# EAGLE design R2p_DCM_v2 (EAGLE 6.2)
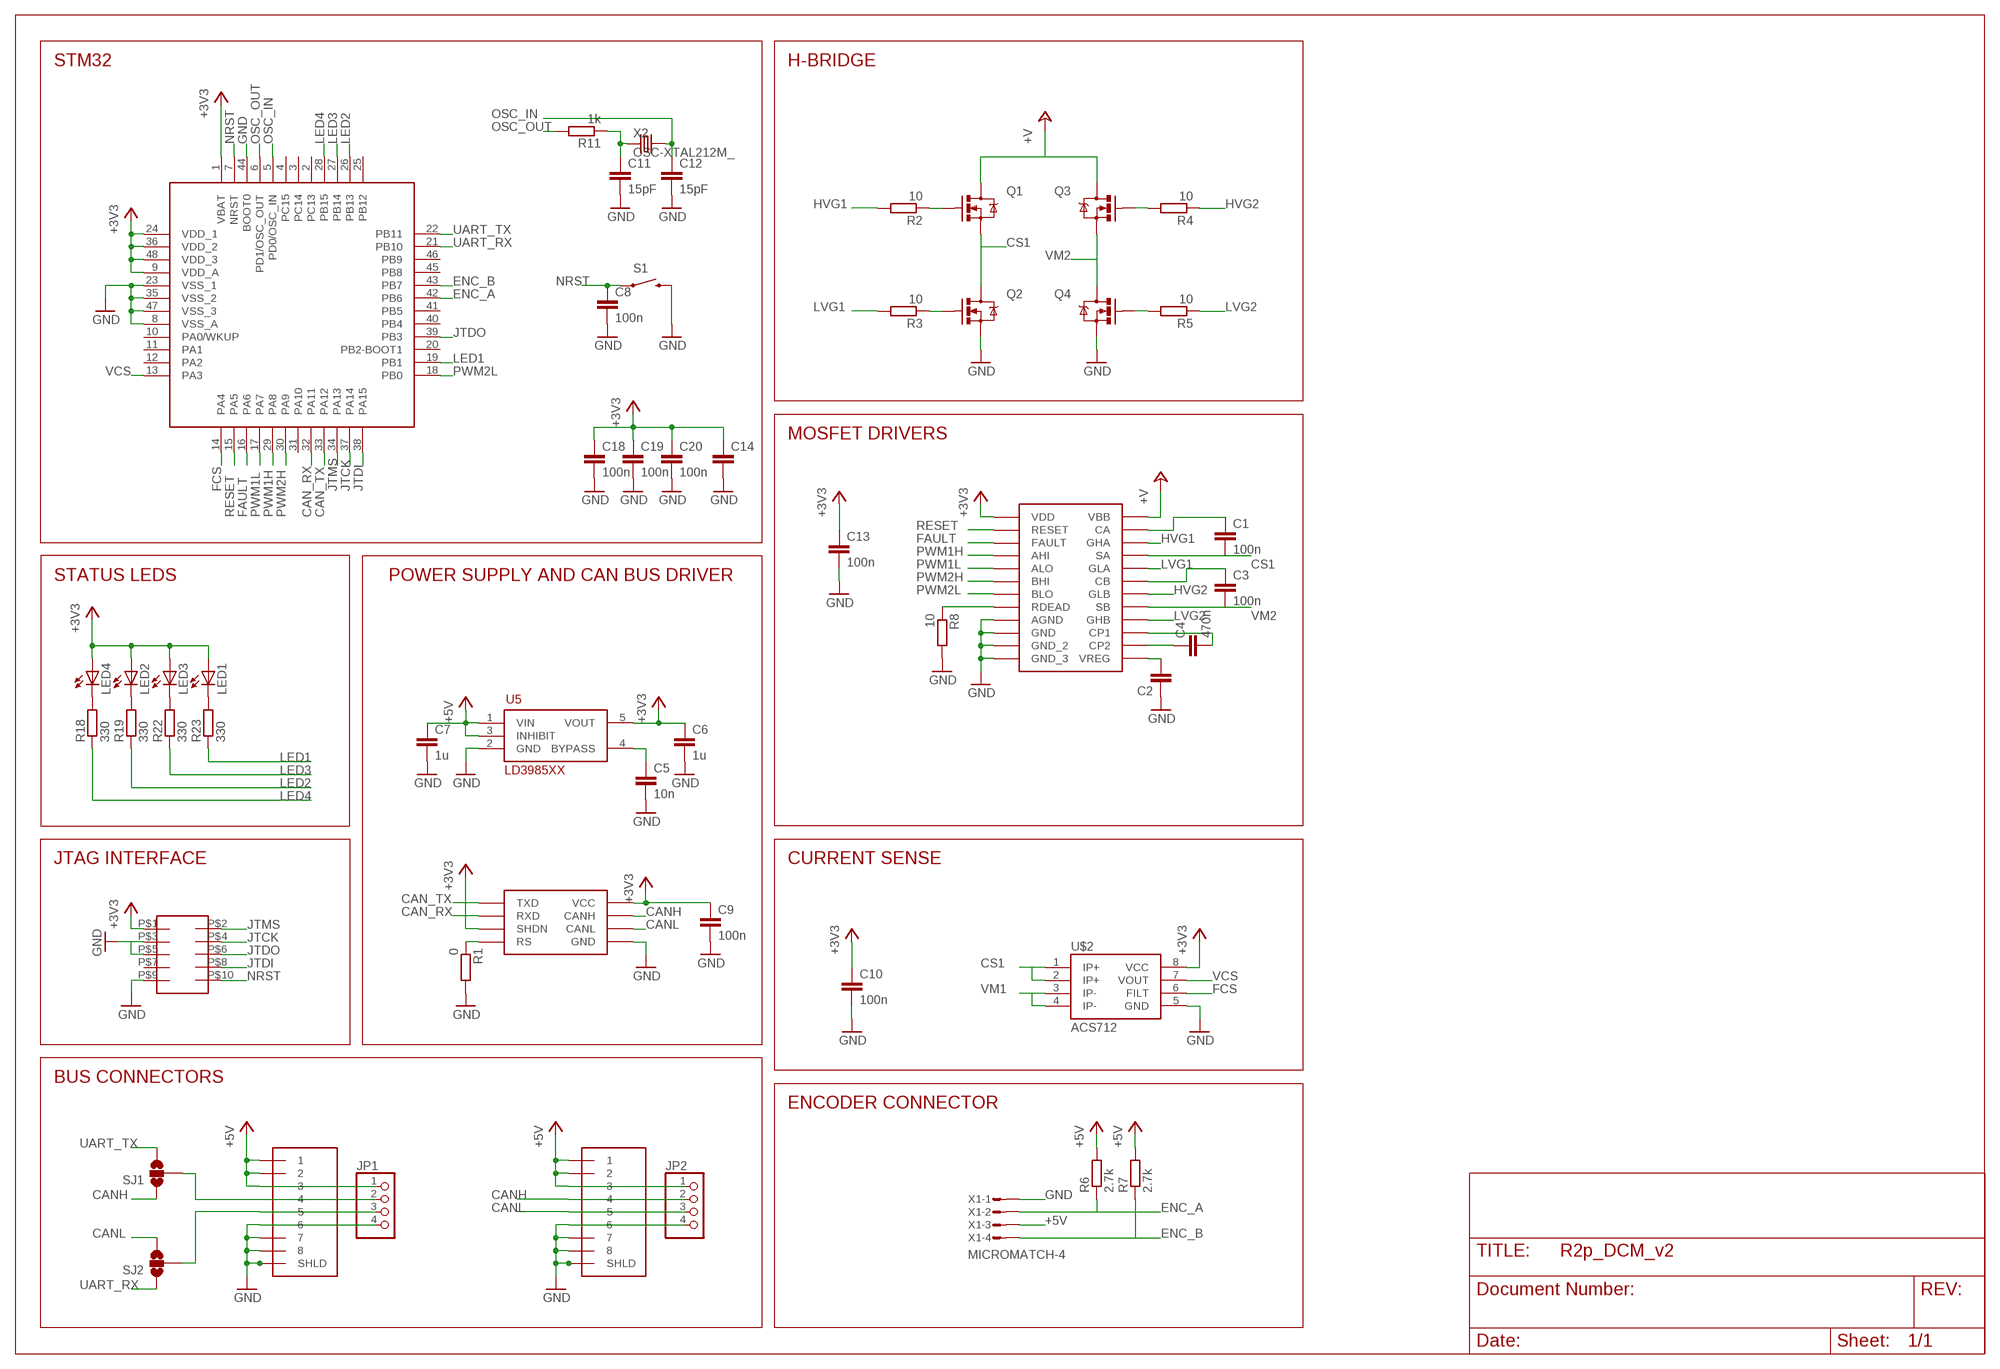
[diagram p0: schematic, sheet 1]

## Parts
1  RJ45-43860  [0438600010]
2  RJ45-43860  [0438600010]
C1  100n  C-EUC0603  [C0603]
C2  C-EUC0805  [C0805]
C3  100n  C-EUC0603  [C0603]
C4  470n  C-EUC0603  [C0603]
C5  10n  C-EUC0603  [C0603]
C6  1u  C-EUC0603  [C0603]
C7  1u  C-EUC0603  [C0603]
C8  100n  C-EUC0603  [C0603]
C9  100n  C-EUC0603  [C0603]
C10  100n  C-EUC0603  [C0603]
C11  15pF  C-EUC0603  [C0603]
C12  15pF  C-EUC0603  [C0603]
C13  100n  C-EUC0603  [C0603]
C14  C-EUC0805  [C0805]
C18  100n  C-EUC0603  [C0603]
C19  100n  C-EUC0603  [C0603]
C20  100n  C-EUC0603  [C0603]
JP1  PINHD-1X4/90  [1X04/90]
JP2  PINHD-1X4/90  [1X04/90]
LED1  LEDCHIPLED_0805  [CHIPLED_0805]
LED2  LEDCHIPLED_0805  [CHIPLED_0805]
LED3  LEDCHIPLED_0805  [CHIPLED_0805]
LED4  LEDCHIPLED_0805  [CHIPLED_0805]
Q1  MOSFET-NCHANNELFDD8580  [DPAK]
Q2  MOSFET-NCHANNELFDD8580  [DPAK]
Q3  MOSFET-NCHANNELFDD8580  [DPAK]
Q4  MOSFET-NCHANNELFDD8580  [DPAK]
R1  0  R-EU_R0603  [R0603]
R2  10  R-EU_R0603  [R0603]
R3  10  R-EU_R0603  [R0603]
R4  10  R-EU_R0603  [R0603]
R5  10  R-EU_R0603  [R0603]
R6  2.7k  R-EU_R0603  [R0603]
R7  2.7k  R-EU_R0603  [R0603]
R8  10  R-EU_R0603  [R0603]
R11  1k  R-EU_R0603  [R0603]
R18  330  R-EU_R0603  [R0603]
R19  330  R-EU_R0603  [R0603]
R22  330  R-EU_R0603  [R0603]
R23  330  R-EU_R0603  [R0603]
S1  SWITCH-MOMENTARY-2-SMD-1101NE  [TACTILE-SWITCH-1101NE]
SJ1  SOLDERJUMPER_2WAYPASTE1&2  [SJ_3_PASTE1&2]
SJ2  SOLDERJUMPER_2WAYPASTE1&2  [SJ_3_PASTE1&2]
SOT1  MAX3051  [SOT23-8L]
U1  STM32F103CX  [LQFP48]
U5  LD3985XX  [SOT23-5L]
U$1  A4940  [TSSOP24]
U$2  ACS712  [SO08]
U$4  FTSH-105  [FTSH-105]
X1  MICROMATCH-4  [MICROMATCH-4]
X2  OSC-XTAL212M_  [4X6]

## Nets
+3V3: C6.1 C9.1 C10.1 C13.1 C14.1 C18.1 C19.1 C20.1 LED1.A LED2.A LED3.A LED4.A SOT1.P$3(VCC) SOT1.P$5(SHDN) U1.1(VBAT) U1.9(VDD_A) U1.24(VDD_1) U1.36(VDD_2) U1.48(VDD_3) U5.5(VOUT) U$1.21(VDD) U$2.8(VCC) U$4.P$1
+5V: 1.P$1 1.P$2 1.P$3 2.P$1 2.P$2 2.P$3 C7.1 JP1.1 JP2.1 R6.2 R7.2 U5.1(VIN) U5.3(INHIBIT) X1.3
+V: Q1.4(D) Q3.4(D) U$1.12(VBB)
CAN_RX: SOT1.P$4(RXD) U1.32(PA11)
CAN_TX: SOT1.P$1(TXD) U1.33(PA12)
CANH: 2.P$4 JP2.2 SJ1.1 SOT1.P$7(CANH)
CANL: 2.P$5 JP2.3 SJ2.3 SOT1.P$6(CANL)
CS1: C1.2 Q1.3(S) Q2.4(D) U$1.10(SA) U$2.1(IP+) U$2.2(IP+)
ENC_A: R6.1 U1.42(PB6) X1.2
ENC_B: R7.1 U1.43(PB7) X1.4
FAULT: U1.16(PA6) U$1.24(FAULT)
FCS: U1.14(PA4) U$2.6(FILT)
GND: 1.P$6 1.P$7 1.P$8 1.P$9(SHLD) 1.P$10 2.P$6 2.P$7 2.P$8 2.P$9(SHLD) 2.P$10 C2.1 C5.2 C6.2 C7.2 C8.2 C9.2 C10.2 C11.2 C12.2 C13.2 C14.2 C18.2 C19.2 C20.2 JP1.4 JP2.4 Q2.3(S) Q4.3(S) R1.2 R8.2 S1.P$2 SOT1.P$2(GND) U1.8(VSS_A) U1.23(VSS_1) U1.35(VSS_2) U1.44(BOOT0) U1.47(VSS_3) U5.2(GND) U$1.2(GND) U$1.15(GND_2) U$1.16(GND_3) U$1.22(AGND) U$2.5(GND) U$4.P$3 U$4.P$9 X1.1
HVG1: R2.2 U$1.9(GHA)
HVG2: R4.1 U$1.3(GLB)
JTCK: U1.37(PA14) U$4.P$4
JTDI: U1.38(PA15) U$4.P$8
JTDO: U1.39(PB3) U$4.P$6
JTMS: U1.34(PA13) U$4.P$2
LED1: R23.1 U1.19(PB1)
LED2: R19.1 U1.26(PB13)
LED3: R22.1 U1.27(PB14)
LED4: R18.1 U1.28(PB15)
LVG1: R3.2 U$1.11(GLA)
LVG2: R5.1 U$1.5(GHB)
N$1: U$4.P$5
N$2: R1.1 SOT1.P$8(RS)
N$3: 1.P$4 JP1.2 SJ1.2
N$4: C5.1 U5.4(BYPASS)
N$5: Q1.1(G) R2.1
N$6: Q2.1(G) R3.1
N$7: Q3.1(G) R4.2
N$8: 1.P$5 JP1.3 SJ2.2
N$9: Q4.1(G) R5.2
N$10: C4.1 U$1.13(CP2)
N$11: C4.2 U$1.14(CP1)
N$12: C11.1 R11.1 X2.1(X1)
N$13: C2.2 U$1.7(VREG)
N$15: LED4.C R18.2
N$16: C3.1 U$1.6(CB)
N$17: R8.1 U$1.23(RDEAD)
N$18: LED2.C R19.2
N$20: LED3.C R22.2
N$22: LED1.C R23.2
N$26: C1.1 U$1.8(CA)
NRST: C8.1 S1.P$1 U1.7(NRST) U$4.P$10
OSC_IN: C12.1 U1.5(PD0/OSC_IN) X2.2(X2)
OSC_OUT: R11.2 U1.6(PD1/OSC_OUT)
PWM1H: U1.29(PA8) U$1.20(AHI)
PWM1L: U1.17(PA7) U$1.19(ALO)
PWM2H: U1.30(PA9) U$1.18(BHI)
PWM2L: U1.18(PB0) U$1.17(BLO)
RESET: U1.15(PA5) U$1.1(RESET)
UART_RX: SJ2.1 U1.21(PB10)
UART_TX: SJ1.3 U1.22(PB11)
VCS: U1.13(PA3) U$2.7(VOUT)
VM1: U$2.3(IP-) U$2.4(IP-)
VM2: C3.2 Q3.3(S) Q4.4(D) U$1.4(SB)
Unconnected: U1.2(PC13) U1.3(PC14) U1.4(PC15) U1.10(PA0/WKUP) U1.11(PA1) U1.12(PA2) U1.20(PB2-BOOT1) U1.25(PB12) U1.31(PA10) U1.40(PB4) U1.41(PB5) U1.45(PB8) U1.46(PB9) U$4.P$7

## Notes on the sheet
- STM32 | H-BRIDGE
- MOSFET DRIVERS
- STATUS LEDS | POWER SUPPLY AND CAN BUS DRIVER
- JTAG INTERFACE | CURRENT SENSE
- BUS CONNECTORS
- ENCODER CONNECTOR

## Library data of the parts
1 2 = molex:RJ45-43860
C1-C14 C18-C20 = rcl:C-EU: CAPACITOR, European symbol
JP1 JP2 = pinhead:PINHD-1X4: PIN HEADER
LED1-LED4 = led:LED: LED OSRAM: - CHIPLED LG R971, LG N971, LY N971, LG Q971, LY Q971, LO R971, LY R971 LH N974, LH R974 LS Q976, LO Q976, LY Q976 LO Q996 - Hyper CHIPLED LW Q18S LB Q993, LB Q99A, LB R99A - SideLED LS A670, LO A670, LY A670, LG A670, LP A670 LB A673, LV A673, LT A673, LW A673 LH A674 LY A675 LS A676, LA A676, LO A676, LY A676, LW A676 LS A679, LY A679, LG A679 - Hyper Micro SIDELED® LS Y876, LA Y876, LO Y876, LY Y876 LT Y87S - SmartLED LW L88C, LW L88S LB L89C, LB L89S, LG L890 LS L89K, LO L89K, LY L89K LS L896, LA L896, LO L896, LY L896 - TOPLED LS T670, LO T670, LY T670, LG T670, LP T670 LSG T670, LSP T670, LSY T670, LOP T670, LYG T670 LG T671, LOG T671, LSG T671 LB T673, LV T673, LT T673, LW T673 LH T674 LS T676, LA T676, LO T676, LY T676, LB T676, LH T676, LSB T676, LW T676 LB T67C, LV T67C, LT T67C, LS T67K, LO T67K, LY T67K, LW E67C LS E67B, LA E67B, LO E67B, LY E67B, LB E67C, LV E67C, LT E67C LW T67C LS T679, LY T679, LG T679 LS T770, LO T770, LY T770, LG T770, LP T770 LB T773, LV T773, LT T773, LW T773 LH T774 LS E675, LA E675, LY E675, LS T675 LS T776, LA T776, LO T776, LY T776, LB T776 LHGB T686 LT T68C, LB T68C - Hyper Mini TOPLED® LB M676 - Mini TOPLED Santana® LG M470 LS M47K, LO M47K, LY M47K Source: http://www.osram.convergy.de LUXEON: - LUMILED® LXK2-PW12-R00, LXK2-PW12-S00, LXK2-PW14-U00, LXK2-PW14-V00 LXK2-PM12-R00, LXK2-PM12-S00, LXK2-PM14-U00 LXK2-PE12-Q00, LXK2-PE12-R00, LXK2-PE12-S00, LXK2-PE14-T00, LXK2-PE14-U00 LXK2-PB12-K00, LXK2-PB12-L00, LXK2-PB12-M00, LXK2-PB14-N00, LXK2-PB14-P00, LXK2-PB14-Q00 LXK2-PR12-L00, LXK2-PR12-M00, LXK2-PR14-Q00, LXK2-PR14-R00 LXK2-PD12-Q00, LXK2-PD12-R00, LXK2-PD12-S00 LXK2-PH12-R00, LXK2-PH12-S00 LXK2-PL12-P00, LXK2-PL12-Q00, LXK2-PL12-R00 Source: www.luxeon.com KINGBRIGHT: KA-3528ASYC Source: www.kingbright.com
Q1-Q4 = SparkFun:MOSFET-NCHANNEL
R1-R8 R11 R18 R19 R22 R23 = rcl:R-EU_: RESISTOR, European symbol
S1 = SparkFun:SWITCH-MOMENTARY-2
SJ1 SJ2 = SparkFun:SOLDERJUMPER_2WAY: Solder Jumper 2 way solder jumper
SOT1 = maxim:MAX3051
U1 = st:STM32F103CX
U5 = st:LD3985XX
U$1 = allegro:A4940
U$2 = SparkFun:ACS712
U$4 = samtec:FTSH-105
X1 = apbteam_con-amp-micromatch:MICROMATCH-4: MicroMaTch 4
X2 = dp_devices:OSC-XTAL2

## Board
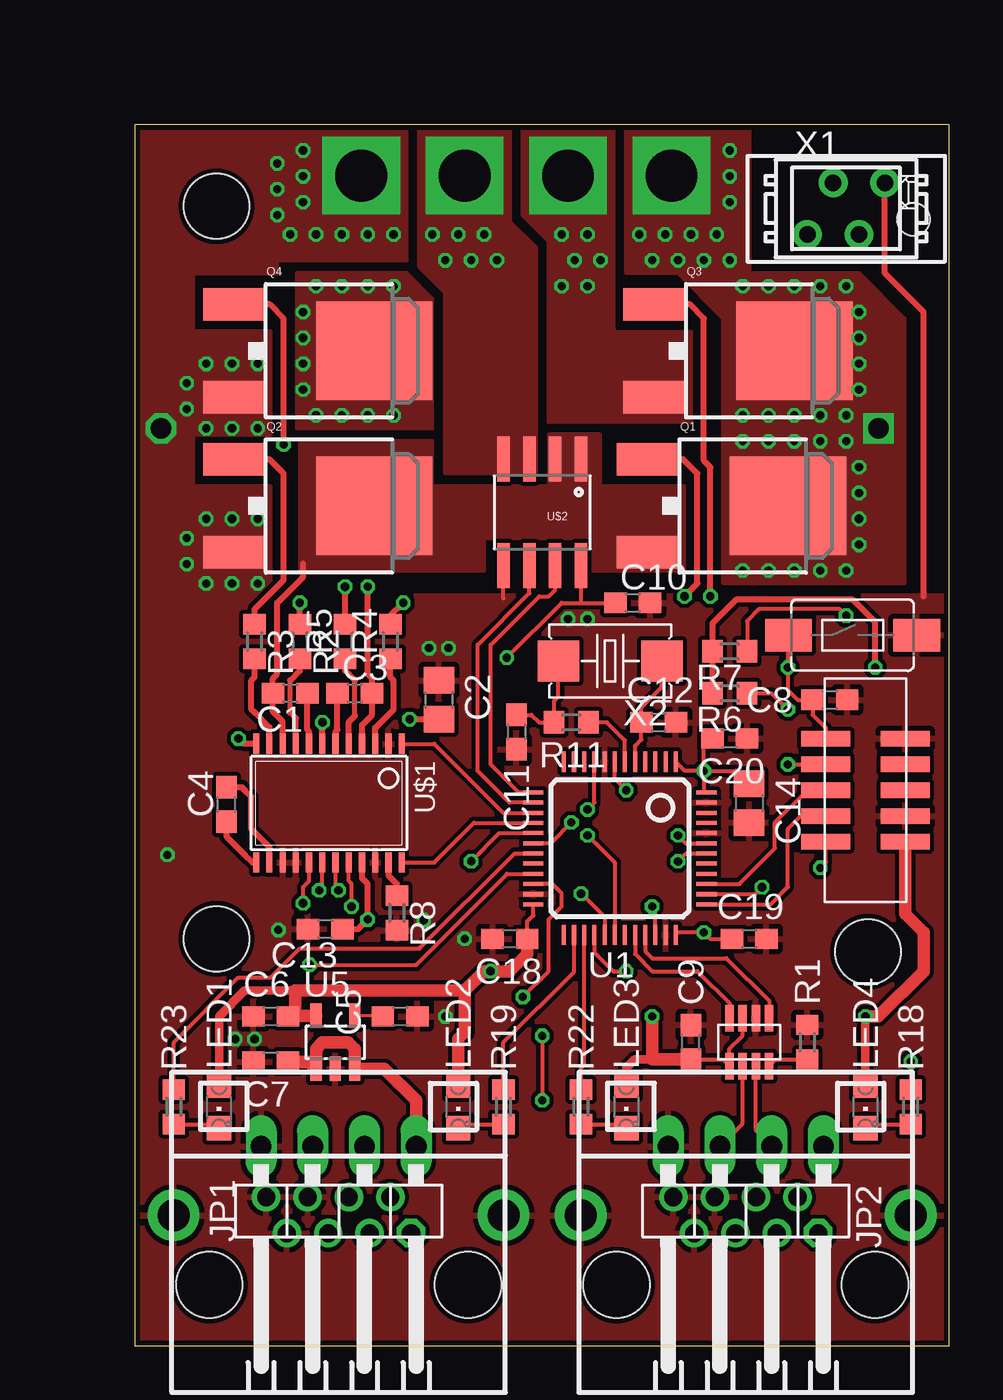
[diagram p1: board, top side]
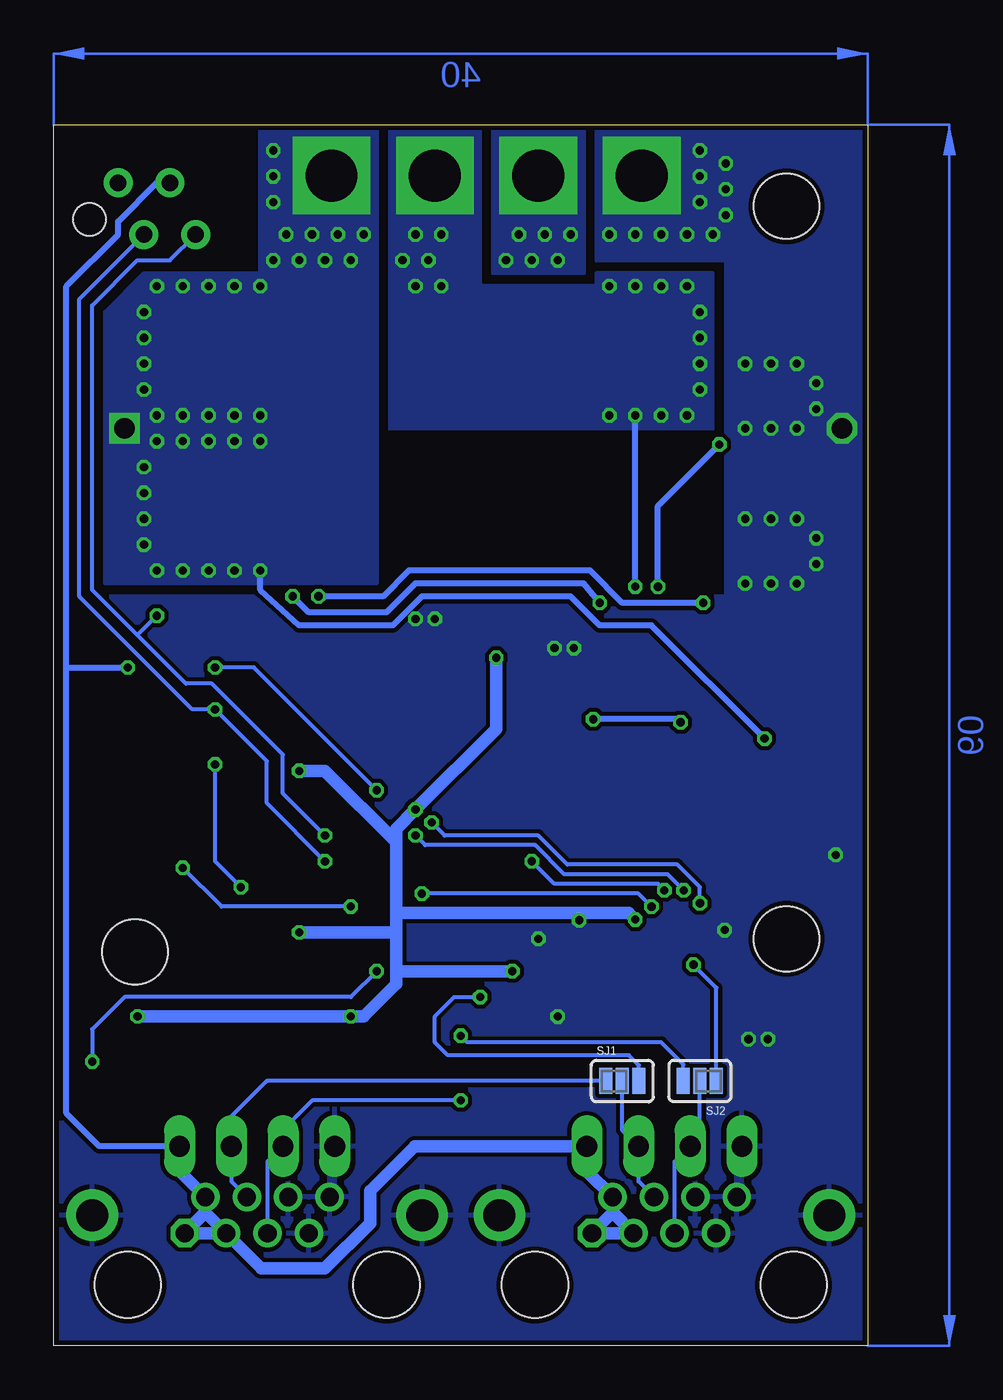
[diagram p2: board, bottom side, seen from below]

Size 40 x 60 mm. Coordinates in mm from the lower left corner, seen from the top.
Outline: 0,0 40,0 40,60 0,60 0,0
Copper layers (1*16): Top 0.035mm / dielectric 1.5mm / Bottom 0.035mm
Design rules: minimum track width 8mil, minimum drill 0.4mm, track to track 8mil, track to pad 8mil, pad to pad 8mil, via to via 8mil, smd to smd 0mil, copper to edge 10mil, drill to drill 10mil, minimum pad ring 10mil, minimum via ring 6mil, stop-mask expansion 2mil, vias tented up to drill 100mil, thermal gap 10mil
Holes 3.2 mm at 4,20 36,19.36 4,56

### Footprints (pad centres in the part's own frame; a part is rotated, then mirrored left to right if it is on the bottom)
0438600010 = drill 0.889 octagon: P$1 3.556,2.54 | drill 0.889: P$2 2.54,4.318; P$3 1.524,2.54; P$4 0.508,4.318; P$5 -0.508,2.54; P$6 -1.524,4.318; P$7 -2.54,2.54; P$8 -3.556,4.318 | drill 1.575 pad 2.54: P$9 8.103,3.429; P$10 -8.103,3.429 | hole 3.251: -6.35,0; 6.35,0
C0603 = smd 1.1 x 1: 1 -0.85,0; 2 0.85,0
C0805 = smd 1.3 x 1.5: 1 -0.95,0; 2 0.95,0
1X04/90 = drill 1.016 long: 1 -3.81,-3.81; 2 -1.27,-3.81; 3 1.27,-3.81; 4 3.81,-3.81
CHIPLED_0805 = smd 1.2 x 1.2: A 0,-1.05; C 0,1.05
DPAK = smd 1.6 x 3: 1 -2.28,-5.31; 3 2.28,-5.31 | smd 4.826 x 5.715: 4 0,1.588
R0603 = smd 1 x 1.1: 1 -0.85,0; 2 0.85,0
TACTILE-SWITCH-1101NE = smd 2.3 x 1.6: P$1 -3.15,0; P$2 3.15,0
SJ_3_PASTE1&2 = smd 0.635 x 1.27: 1 -0.813,0; 2 0,0; 3 0.813,0
SOT23-8L@1 = smd 1.3 x 0.42: P$1 -1.175,1.3; P$2 -1.175,0.65; P$3 -1.175,0; P$4 -1.175,-0.65; P$5 1.175,-0.65; P$6 1.175,0; P$7 1.175,0.65; P$8 1.175,1.3
LQFP48 = smd 1 x 0.2: 1 -4.25,2.75; 2 -4.25,2.25; 3 -4.25,1.75; 4 -4.25,1.25; 5 -4.25,0.75; 6 -4.25,0.25; 7 -4.25,-0.25; 8 -4.25,-0.75; 9 -4.25,-1.25; 10 -4.25,-1.75; 11 -4.25,-2.25; 12 -4.25,-2.75; 25 4.25,-2.75; 26 4.25,-2.25; 27 4.25,-1.75; 28 4.25,-1.25; 29 4.25,-0.75; 30 4.25,-0.25; 31 4.25,0.25; 32 4.25,0.75; 33 4.25,1.25; 34 4.25,1.75; 35 4.25,2.25; 36 4.25,2.75 | smd 0.2 x 1: 13 -2.75,-4.25; 14 -2.25,-4.25; 15 -1.75,-4.25; 16 -1.25,-4.25; 17 -0.75,-4.25; 18 -0.25,-4.25; 19 0.25,-4.25; 20 0.75,-4.25; 21 1.25,-4.25; 22 1.75,-4.25; 23 2.25,-4.25; 24 2.75,-4.25; 37 2.75,4.25; 38 2.25,4.25; 39 1.75,4.25; 40 1.25,4.25; 41 0.75,4.25; 42 0.25,4.25; 43 -0.25,4.25; 44 -0.75,4.25; 45 -1.25,4.25; 46 -1.75,4.25; 47 -2.25,4.25; 48 -2.75,4.25
SOT23-5L = smd 0.55 x 1.2: 1 -0.95,-1.3; 2 0,-1.3; 3 0.95,-1.3; 4 0.95,1.3; 5 -0.95,1.3
TSSOP24 = smd 0.305 x 0.991: 1 -3.575,-2.918; 2 -2.925,-2.918; 3 -2.275,-2.918; 4 -1.625,-2.918; 5 -0.975,-2.918; 6 -0.325,-2.918; 7 0.325,-2.918; 8 0.975,-2.918; 9 1.625,-2.918; 10 2.275,-2.918; 11 2.925,-2.918; 12 3.575,-2.918; 13 3.575,2.918; 14 2.925,2.918; 15 2.275,2.918; 16 1.625,2.918; 17 0.975,2.918; 18 0.325,2.918; 19 -0.325,2.918; 20 -0.975,2.918; 21 -1.625,2.918; 22 -2.275,2.918; 23 -2.925,2.918; 24 -3.575,2.918
SO08 = smd 0.61 x 2.21: 1 -1.905,-2.616; 2 -0.635,-2.616; 3 0.635,-2.616; 4 1.905,-2.616; 5 1.905,2.616; 6 0.635,2.616; 7 -0.635,2.616; 8 -1.905,2.616
FTSH-105 = smd 0.76 x 2.4: P$1 -2.54,-1.95; P$2 -2.54,1.95; P$3 -1.27,-1.95; P$4 -1.27,1.95; P$5 0,-1.95; P$6 0,1.95; P$7 1.27,-1.95; P$8 1.27,1.95; P$9 2.54,-1.95; P$10 2.54,1.95
MICROMATCH-4 = drill 0.813 pad 1.422: 1 1.905,1.27; 2 0.635,-1.27; 3 -0.635,1.27; 4 -1.905,-1.27 | hole 1.6: 3.305,-0.53
4X6 = smd 2.032 x 2.032: 1 -2.54,0; 2 2.54,0

### Placement (x,y rotation side)
1  10,3 0 top
2  30,3 0 top
C1  7.62,32.07 180 top
C2  14.92,31.75 270 top
C3  10.79,32.07 0 top
C4  4.49,26.61 90 top
C5  13.02,16.19 0 top
C6  6.67,16.19 180 top
C7  6.67,13.97 180 top
C8  34.13,31.75 0 top
C9  27.3,14.92 90 top
C10  24.45,36.51 0 top
C11  18.73,30.16 270 top
C12  25.72,30.64 0 top
C13  9.34,20.48 180 top
C14  30.16,26.67 270 top
C18  18.41,20 180 top
C19  30.16,20 0 top
C20  29.21,29.84 0 top
JP1  10,6 180 top
JP2  30,6 180 top
LED1  4.13,11.75 180 top
LED2  15.88,11.75 180 top
LED3  24.13,11.75 180 top
LED4  35.88,11.75 180 top
Q1  30.48,41.27 270 top
Q2  10.16,41.27 270 top
Q3  30.8,48.9 270 top
Q4  10.16,48.9 270 top
R1  33.02,14.92 90 top
R2  8.1,34.61 270 top
R3  5.87,34.61 270 top
R4  12.54,34.61 90 top
R5  10.32,34.61 90 top
R6  29.21,32.07 180 top
R7  29.21,34.13 180 top
R8  12.86,21.27 270 top
R11  21.43,30.64 0 top
R18  38.1,11.75 270 top
R19  18.1,11.75 270 top
R22  21.91,11.75 270 top
R23  1.91,11.75 270 top
S1  35.24,34.92 0 top
SJ1  12.06,13.02 0 bottom
SJ2  8.26,13.02 180 bottom
SOT1  MAX3051  [SOT23-8L@1]  29.84,14.92 270 top
U1  23.81,24.45 270 top
U5  9.84,14.92 0 top
U$1  9.53,26.67 180 top
U$2  20,40.96 180 top
U$4  35.88,27.3 90 top
X1  34.92,55.88 0 top
X2  23.34,33.66 0 top

### Tracks (layer width: path | path; a pad name or v marks a point on that pad's centre or on a via)
+3V3  (via drill 0.4, 0.41)
  Top 0.203: U1.36 26.68,20.32 v27.94,20.32 28.26,20 C19.1 | C9.1 28.87,14.07 SOT1.P$5 29.2,14.59 29.84,15.24 SOT1.P$3 | U1.48 27.94,27.32 v27.94,28.26 | U1.1 27,28.26 v27.94,28.26 | LED4.A 35.88,13.97 | U1.9 22.56,26.69 v22.23,26.35 | C14.1 29.52,28.26 v27.94,28.26 | v27.94,28.26 27.94,29.43 C20.1 | 21.91,36.51 C10.1 | 21.91,36.51 U$2.8 | U1.24 19.56,21.15 19.27,20.85 C18.1 | 21.91,36.51 20.95,36.51 v18.26,33.81
  Top 0.254: 7.87,16.22 C6.1
  Top 0.305: U$1.21 11.15,22.98 11.43,22.7 v11.43,20.95 | v11.43,20.95 | C13.1 10.95,20.48 v11.43,20.95
  Top 0.406: LED1.A 4.13,16.19 5.4,17.46 7.87,17.46 | 25.4,14.07 24.55,14.07 24.13,13.65 LED3.A | v35.88,16.19 LED4.A
  Top 0.61: U5.5 7.87,16.22 7.87,17.46 16.19,17.46 | 16.19,17.46 17.14,18.41 v17.46,18.41 18.41,18.41 19.27,19.27 C18.1 | C9.1 25.4,14.07 v25.4,16.19 | U$4.P$1 37.83,21.23 38.73,20.32 38.73,18.41 36.51,16.19 v35.88,16.19 | 16.19,17.46 16.19,15.4 15.88,15.08 LED2.A
  Bottom 0.61: v17.46,18.41 23.18,18.41 | v35.88,16.19 v25.4,16.19 24.77,16.19 23.18,17.78 23.18,18.41 | 23.18,24.77 23.18,25.4 v22.23,26.35 18.26,30.32 v18.26,33.81 | 23.18,18.41 23.18,20.32 | 23.18,20.32 23.18,21.27 | 23.18,21.27 23.18,24.77 | v27.94,28.26 26.67,28.26 23.18,24.77 | 23.18,20.32 v27.94,20.32 | v11.43,20.95 11.75,21.27 23.18,21.27
  other vias: 11.43,20.96
+5V  (via drill 0.4)
  Top 0.305: R6.2 R7.2 28.36,35.5 29.53,36.67 35.24,36.67 36.35,35.56 v36.35,33.34
  Top 0.61: JP1.1 13.81,12.06 12.25,13.62 U5.3 10.79,14.61 10.48,14.92 9.21,14.92 8.89,14.61 U5.1 8.54,13.97 C7.1
  Bottom 0.305: X1.3 34.92,57.15 36.83,55.24 36.83,54.61 39.37,52.07 39.37,33.34 | JP2.1 37.75,9.81 39.37,11.43 39.37,33.34 | 39.37,33.34 v36.35,33.34
  Bottom 0.61: 12.54,6.56 1.P$1 11.57,5.54 | 12.54,6.56 1.P$2 13.81,8.59 JP1.1 22.26,9.81 24.45,7.62 24.45,6.03 26.67,3.81 29.79,3.81 2.P$3 | 12.54,6.56 1.P$3 | 2.P$3 32.54,6.56 | 2.P$3 2.P$1 32.54,6.56 | 32.54,6.56 2.P$2 33.81,8.59 JP2.1
+V  (via drill 0.4, 0.41, 1, 2.54 pad 3.81)
  Top 0.305: U$1.12 5.34,29.59 v5.08,29.84
  Bottom 0.305: v29.84,38.1 29.84,37.15 27.94,35.4 23.34,35.4 21.91,36.83 14.61,36.83 13.18,35.4 10.64,35.4 v5.08,29.84
  other vias: 26.35,57.5 35.56,50.8 35.56,49.53 35.56,48.26 35.56,46.99 34.92,45.72 33.66,45.72 32.38,45.72 31.11,45.72 29.84,45.72 29.84,52.07 31.11,52.07 32.38,52.07 33.66,52.07 34.92,52.07 29.84,44.45 31.11,44.45 32.38,44.45 33.66,44.45 34.92,44.45 35.56,43.18 35.56,41.91 35.56,40.64 35.56,39.37 34.92,38.1 33.66,38.1 32.38,38.1 31.11,38.1 24.77,54.61 26.04,54.61 27.3,54.61 29.21,58.74 29.21,57.47 29.21,56.2 26.67,53.34 27.94,53.34 25.4,53.34 28.57,54.61 29.21,53.34 36.51,45.09
  pour Top (no thermals): 24.13,60.01 30.16,60.01 30.16,52.7 35.56,52.7 37.78,50.48 37.78,37.47 28.89,37.47 28.89,50.48 26.67,52.7 24.13,52.7
  pour Bottom (no thermals): 24.13,60.01 24.13,37.47 37.47,37.47 37.47,50.8 35.56,52.7 29.84,52.7 29.84,60.01
CAN_RX
  Top 0.203: 29.21,16.11 29.21,16.83 27.62,18.41 25.4,18.41 24.56,19.25 U1.32
  Top 0.254: 29.21,16.11 SOT1.P$4
CAN_TX
  Top 0.203: SOT1.P$1 31.14,16.96 29.05,19.05 25.4,19.05 25.06,19.39 U1.33
CANH
  Top 0.203: SOT1.P$7 30.5,10.59 JP2.2
  Bottom 0.203: 2.P$4 31.27,8.08 JP2.2 31.27,11.28 29.53,13.02 SJ1.1
CANL  (via drill 0.4)
  Top 0.203: SOT1.P$6 29.84,10.93 JP2.3 | v20,15.24 v20,12.06
  Bottom 0.203: 2.P$5 29.49,9.05 JP2.3 28.73,10.64 27.3,12.06 v20,12.06 | v20,15.24 19.68,14.92 10.16,14.92 9.07,13.83 SJ2.3
CS1
  Top 0.305: U$1.10 7.25,30.69 6.77,31.17 C1.2 6.77,32.8 6.99,33.02 6.99,36.51 8.26,37.78 8.26,38.42
  pour Top (no thermals): 8.1,38.1 17.14,38.1 17.14,39.69 22.23,39.69 22.23,38.1 26.99,38.1 26.99,42.23 22.86,42.23 22.86,44.77 20.32,44.77 20.32,42.23 14.61,42.23 14.61,44.45 8.1,44.45
ENC_A  (via drill 0.4)
  Top 0.203: U1.42 27.05,24.2 v26.67,23.81 | R6.1 31.27,32.07 v32.07,31.27
  Bottom 0.203: X1.2 38.73,51.44 38.73,36.83 33.18,31.27 v32.07,31.27 29.53,28.73 29.53,26.67 v26.67,23.81
ENC_B  (via drill 0.4)
  Top 0.203: U1.43 27.05,24.7 v26.67,25.08 | R7.1 30.06,35.62 30.64,36.2 34.61,36.2 v34.92,35.88
  Bottom 0.203: X1.4 34.29,53.34 35.88,53.34 38.1,51.12 38.1,37.15 35.88,34.92 | 35.88,34.92 v34.92,35.88 | 35.88,34.92 33.5,32.54 32.23,32.54 28.73,29.05 28.73,27.15 v26.67,25.08
FAULT
  Top 0.203: U$1.24 14.7,23.75 16.65,25.7 U1.16
FCS
  Top 0.203: U$2.6 19.37,36.99 16.83,34.45 16.83,28.26 18.39,26.7 U1.14
GND  (via drill 0.4, 0.41, 1, 2.54 pad 3.81)
  Top 0.203: 18.1,36.73 U$2.5
  Top 0.305: X1.1 36.83,52.7 38.73,50.8 38.73,36.83
  other vias: 11.11,57.5 6.03,45.09 4.76,45.09 3.49,45.09 2.54,46.04 2.54,47.31 3.49,48.26 4.76,48.26 6.03,48.26 6.03,40.64 4.76,40.64 3.49,40.64 2.54,39.69 2.54,38.42 3.49,37.47 4.76,37.47 6.03,37.47 12.7,54.61 11.43,54.61 10.16,54.61 8.89,54.61 8.26,57.47 8.26,58.74 8.26,56.2 6.99,58.1 6.99,56.83 6.99,55.56 7.62,54.61 1.59,24.13 16.19,20 1.27,45.09 15.24,16.19 4.92,15.08 5.87,15.08 15.4,34.29 14.45,34.29 22.23,35.72 21.27,35.72 7.04,20.44 14.18,20.91
  pour Top: 0,0 40,0 40,36.83 0,36.83
  pour Bottom: 0,0 40.01,0 40.01,36.83 0,36.83
  pour Top (no thermals): 13.34,60.01 0,60.01 0,36.83 6.67,36.83 6.67,42.23 2.86,42.23 2.86,44.77 6.67,44.77 6.67,49.85 2.86,49.85 2.86,52.7 6.99,52.7 6.99,53.34 13.34,53.34
  pour Bottom (no thermals): 13.34,60.01 13.34,53.34 6.99,53.34 6.99,36.2 0,36.2 0,60.01
HVG1
  Top 0.254: 7.62,31.11 7.62,32.7
  Top 0.305: U$1.9 7.9,30.84 7.62,31.11 | 7.62,32.7 8.1,33.18 R2.2
HVG2
  Top 0.305: U$1.3 11.8,30.37 12.7,31.27 12.7,32.7 12.54,32.86 R4.1
JTCK
  Top 0.203: 32.7,26.04 32.07,25.4 32.07,22.54 31.22,21.7 U1.37
  Top 0.254: 32.7,26.04 U$4.P$4
JTDI  (via drill 0.4)
  Top 0.203: U1.38 30.45,22.2 v30.8,22.54 | v32.07,28.57 U$4.P$8
  Bottom 0.203: v30.8,22.54 32.07,23.81 v32.07,28.57
JTDO
  Top 0.203: 33.02,27.3 31.43,25.72 31.43,24.45 29.68,22.7 U1.39
  Top 0.254: 33.02,27.3 U$4.P$6
JTMS  (via drill 0.4)
  Top 0.203: U$4.P$2 33.93,23.77 v33.66,23.5 | U1.34 25.56,21.43 v25.4,21.59
  Bottom 0.203: v25.4,21.59 31.75,21.59 v33.66,23.5
LED1
  Top 0.203: U1.19 18.64,24.2 13.97,19.53 8.1,19.53 6.67,18.1 5.08,18.1 1.91,14.92 R23.1
LED2
  Top 0.203: U1.26 21.56,18.39 18.1,14.92 R19.1
LED3
  Top 0.203: U1.27 22.06,13.81 21.91,13.65 R22.1
LED4  (via drill 0.4)
  Top 0.203: v38.1,13.97 R18.1 | U1.28 22.56,19.35 23.5,18.41 v24.13,18.41
  Bottom 0.203: v24.13,18.41 25.4,17.14 36.51,17.14 38.1,15.56 v38.1,13.97
LVG1
  Top 0.305: U$1.11 6.6,30.39 5.87,31.11 5.71,31.27 5.71,32.7 5.87,32.86 R3.2
LVG2
  Top 0.203: 10.32,33.18 R5.1
  Top 0.254: 10.79,30.96 10.79,32.7
  Top 0.305: U$1.5 10.5,30.66 10.79,30.96 | 10.79,32.7 10.32,33.18
N$2
  Top 0.203: R1.1 31.47,14.07 SOT1.P$8
N$3
  Bottom 0.203: SJ1.2 12.06,10.61 JP1.2 11.27,8.08 1.P$4
N$4
  Top 0.152: U5.4 12.14,16.22 C5.1
N$5  (via drill 0.4)
  Top 0.305: Q1.1 26.93,43.55 27.62,42.86 27.62,37.47 v26.99,36.83 | R2.1 v8.1,36.51
  Bottom 0.305: v26.99,36.83 23.81,36.83 22.54,38.1 13.65,38.1 12.06,36.51 v8.1,36.51
N$6
  Top 0.305: Q2.1 6.61,43.55 7.3,42.86 7.3,37.62 5.87,36.2 R3.1
N$7  (via drill 0.4)
  Top 0.305: Q3.1 27.25,51.17 27.94,50.48 27.94,43.5 28.26,43.18 v28.26,36.83 | R4.2 12.54,35.88 v13.18,36.51
  Bottom 0.305: v28.26,36.83 27.46,36.04 23.65,36.04 22.23,37.47 13.97,37.47 v13.18,36.51
N$8
  Bottom 0.203: SJ2.2 8.26,10.29 JP1.3 9.49,9.05 1.P$5
N$9  (via drill 0.41)
  Top 0.305: Q4.1 6.61,51.17 7.3,50.48 v7.3,44.29 | R5.2 v10.32,37.31
  Bottom 0.305: v7.3,44.29 10.32,41.27 v10.32,37.31
N$10
  Top 0.305: C4.1 4.49,25.03 5.4,24.13 5.78,23.75 U$1.13
N$11
  Top 0.305: U$1.14 6.6,24.52 5.71,25.4 5.71,26.99 5.4,27.3 5.25,27.45 C4.2
N$12
  Top 0.203: X2.1 20.8,31.91 20.58,31.69 R11.1 19.84,30.64 19.47,31.01 C11.1
N$13  (via drill 0.41)
  Top 0.203: v9.2,30.63 v9.21,30.64
  Top 0.305: U$1.7 v9.2,30.63 | C2.2 v13.5,30.8 v13.49,30.8
  Bottom 0.305: v13.49,30.8 9.37,30.8 v9.21,30.64
N$15
  Top 0.203: R18.2 36.08,10.9 LED4.C
N$16
  Top 0.305: C3.1 9.95,30.27 9.85,30.17 U$1.6
N$17
  Top 0.305: U$1.23 12.45,23.11 12.7,22.86 12.86,22.7 R8.1
N$18
  Top 0.203: R19.2 16.07,10.9 LED2.C
N$20
  Top 0.203: R22.2 23.93,10.9 LED3.C
N$22
  Top 0.203: R23.2 3.93,10.9 LED1.C
N$26
  Top 0.305: C1.1 8.47,30.27 8.55,30.18 U$1.8
NRST  (via drill 0.4)
  Top 0.203: 33.66,30.12 U$4.P$10 33.93,30.37 33.28,31.01 C8.1 32.54,31.75 32.07,32.23 v32.07,33.34 32.09,33.36 S1.P$1 | U1.7 23.56,27.87 v24.13,27.3
  Bottom 0.203: v32.07,33.34 30.16,33.34 v24.13,27.3
OSC_IN
  Top 0.203: U1.5 24.56,29.48 24.87,29.79 C12.1 24.87,31.38 25.88,32.38 X2.2
OSC_OUT
  Top 0.203: U1.6 24.06,29.75 23.18,30.64 R11.2
PWM1H  (via drill 0.4, 0.41)
  Top 0.203: U1.29 23.06,21.07 v21.91,22.23 | U$1.20 10.5,22.84 10.64,22.7 v10.64,21.59 | v10.64,21.59
  Bottom 0.203: v21.91,22.23 11.27,22.23 v10.64,21.59
PWM1L  (via drill 0.41)
  Top 0.203: U1.17 17.89,25.2 v16.51,23.81 | U$1.19 9.85,22.54 v10,22.38
  Bottom 0.203: v16.51,23.81 15.4,22.7 10.32,22.7 v10,22.38 | v10,22.38
PWM2H  (via drill 0.4, 0.41)
  Top 0.203: U1.30 23.56,23.75 v22.23,25.08 | U$1.18 9.2,22.54 v9.05,22.38
  Bottom 0.203: v22.23,25.08 21.75,24.61 16.35,24.61 14.92,23.18 9.84,23.18 v9.05,22.38
PWM2L  (via drill 0.4, 0.41)
  Top 0.203: U$1.17 8.55,22.84 8.26,22.54 v8.26,21.75 | U1.18 20.41,24.7 v21.43,25.72
  Bottom 0.203: v21.43,25.72 20.8,25.08 16.19,25.08 14.76,23.65 9.37,23.65 8.26,22.54 v8.26,21.75
RESET
  Top 0.203: U1.15 18.09,26.2 14.7,29.59 U$1.1
UART_RX  (via drill 0.4)
  Top 0.203: U1.21 18.28,23.2 13.81,18.73 v8.57,18.73
  Bottom 0.203: SJ2.1 7.44,17.6 v8.57,18.73
UART_TX  (via drill 0.4)
  Top 0.203: U1.22 20.48,22.7 20.95,22.23 20.95,21.59 20.32,20.95 20.32,18.41 v19.05,17.14
  Bottom 0.203: SJ1.3 11.25,13.79 11.75,14.29 20.64,14.29 21.27,14.92 21.27,16.19 20.32,17.14 v19.05,17.14
VCS
  Top 0.203: U$2.7 20.64,37.15 20.32,36.83 19.84,36.83 17.46,34.45 17.46,28.57 18.84,27.2 U1.13
VM1  (via drill 0.4, 2.54 pad 3.81)
  other vias: 16.19,57.5 14.61,54.61 15.88,54.61 17.14,54.61 17.78,53.34 16.51,53.34 15.24,53.34
  pour Top (no thermals): 13.97,60.01 18.41,60.01 18.41,55.24 19.68,53.98 19.68,42.86 15.24,42.86 15.24,51.75 13.97,53.02
  pour Bottom: 13.97,60.01 13.97,52.7 18.41,52.7 18.41,60.01
VM2  (via drill 0.4, 2.54 pad 3.81)
  Top 0.305: U$1.4 11.15,30.52 11.64,31.01 C3.2 11.64,32.8 11.43,33.02 v11.43,37.31
  Bottom 0.305: v11.43,37.31 v11.43,45.72
  other vias: 21.27,57.5 12.7,52.07 11.43,52.07 10.16,52.07 8.89,52.07 8.26,50.8 8.26,49.53 8.26,48.26 8.26,46.99 8.89,45.72 10.16,45.72 12.7,45.72 20.95,54.61 22.23,54.61 20.95,52.07 22.23,52.07 22.86,53.34 21.59,53.34
  pour Top (no thermals): 19.05,60.01 23.5,60.01 23.5,52.7 23.5,49.85 27.3,49.85 27.3,45.4 20.32,45.4 20.32,54.29 19.05,55.56
  pour Top (no thermals): 14.61,51.44 13.34,52.7 7.94,52.7 7.94,45.09 14.61,45.09
  pour Bottom (no thermals): 23.5,60.01 23.5,45.09 7.62,45.09 7.62,52.7 13.34,52.7 13.34,52.07 19.05,52.07 19.05,60.01
(copper drawn outside any net)
  shapes: Bottom area x2

### Text on the board
_tsilk: RST | 1 | JTAG
_bsilk: UART | CAN | UART | CAN